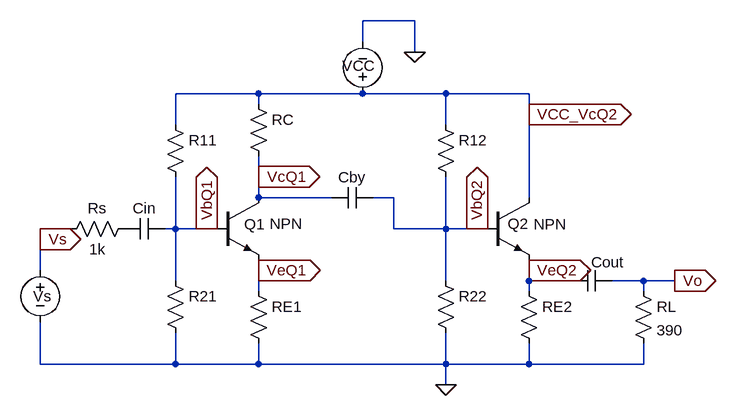
[diagram p0: schematic assigned_schematic_RsRL_only.asc]
assigned_schematic_RsRL_only.asc, the LTspice schematic file:
Version 4
SHEET 1 936 680
WIRE 416 -160 336 -160
WIRE 336 -128 336 -160
WIRE 416 -112 416 -160
WIRE 176 -48 48 -48
WIRE 336 -48 176 -48
WIRE 464 -48 336 -48
WIRE 592 -48 464 -48
WIRE 176 -32 176 -48
WIRE 592 -16 592 -48
WIRE 48 0 48 -48
WIRE 464 0 464 -48
WIRE 176 80 176 48
WIRE 176 112 176 80
WIRE 288 112 176 112
WIRE 384 112 352 112
WIRE 592 112 592 -16
WIRE -112 160 -160 160
WIRE 48 160 48 80
WIRE 48 160 32 160
WIRE 96 160 48 160
WIRE 112 160 96 160
WIRE 384 160 384 112
WIRE 464 160 464 80
WIRE 464 160 384 160
WIRE 512 160 464 160
WIRE 528 160 512 160
WIRE -160 176 -160 160
WIRE -160 224 -160 176
WIRE 176 224 176 208
WIRE 592 224 592 208
WIRE 48 240 48 160
WIRE 464 240 464 160
WIRE 592 240 592 224
WIRE 656 240 592 240
WIRE 768 240 720 240
WIRE 816 240 768 240
WIRE 176 256 176 224
WIRE 592 256 592 240
WIRE 768 256 768 240
WIRE -160 368 -160 304
WIRE 48 368 48 320
WIRE 48 368 -160 368
WIRE 176 368 176 336
WIRE 176 368 48 368
WIRE 464 368 464 320
WIRE 464 368 176 368
WIRE 592 368 592 336
WIRE 592 368 464 368
WIRE 768 368 768 336
WIRE 768 368 592 368
WIRE 464 400 464 368
FLAG 416 -112 0
FLAG 464 400 0
FLAG 816 240 Vo
IOPIN 816 240 Out
FLAG 592 -16 VCC_VcQ2
IOPIN 592 -16 Out
FLAG 512 160 VbQ2
IOPIN 512 160 Out
FLAG 96 160 VbQ1
IOPIN 96 160 Out
FLAG 176 224 VeQ1
IOPIN 176 224 Out
FLAG 176 80 VcQ1
IOPIN 176 80 Out
FLAG 592 224 VeQ2
IOPIN 592 224 Out
FLAG -160 176 Vs
IOPIN -160 176 Out
SYMBOL cap 352 96 R90
WINDOW 0 0 32 VBottom 2
WINDOW 3 32 32 VTop 2
SYMATTR InstName Cby
SYMATTR Value ""
SYMBOL res 32 -16 R0
SYMATTR InstName R11
SYMATTR Value ""
SYMBOL res 32 224 R0
SYMATTR InstName R21
SYMATTR Value ""
SYMBOL res 448 -16 R0
WINDOW 3 -33 28 Left 2
SYMATTR Value ""
SYMATTR InstName R12
SYMBOL res 448 224 R0
SYMATTR InstName R22
SYMATTR Value ""
SYMBOL res 160 -48 R0
SYMATTR InstName RC
SYMATTR Value ""
SYMBOL res 160 240 R0
SYMATTR InstName RE1
SYMATTR Value ""
SYMBOL res 576 240 R0
SYMATTR InstName RE2
SYMATTR Value ""
SYMBOL res 752 240 R0
SYMATTR InstName RL
SYMATTR Value 390
SYMBOL voltage 336 -32 R180
WINDOW 0 -19 59 Left 2
WINDOW 3 -37 99 Left 2
WINDOW 123 0 0 Left 0
WINDOW 39 0 0 Left 0
SYMATTR InstName VCC
SYMATTR Value ""
SYMBOL voltage -160 208 R0
WINDOW 0 -11 56 Left 2
WINDOW 3 39 70 Left 1
WINDOW 123 43 89 Left 1
WINDOW 39 0 0 Left 0
SYMATTR InstName Vs
SYMATTR Value ""
SYMBOL cap 720 224 R90
WINDOW 0 3 7 VBottom 2
WINDOW 3 23 5 VTop 2
SYMATTR InstName Cout
SYMATTR Value ""
SYMBOL cap 32 144 R90
WINDOW 0 0 32 VBottom 2
WINDOW 3 32 32 VTop 2
SYMATTR InstName Cin
SYMATTR Value ""
SYMBOL res -16 144 R90
WINDOW 0 0 56 VBottom 2
WINDOW 3 32 56 VTop 2
SYMATTR InstName Rs
SYMATTR Value 1k
SYMBOL npn 112 112 R0
WINDOW 0 42 41 Left 2
WINDOW 3 81 40 Left 2
SYMATTR InstName Q1
SYMBOL npn 528 112 R0
WINDOW 0 31 40 Left 2
WINDOW 3 71 41 Left 2
SYMATTR InstName Q2

The netlist it stands for:
* assigned_schematic_RsRL_only.asc
Cby VbQ2 VcQ1
R11 VCC_VcQ2 VbQ1
R21 VbQ1 0
R12 VCC_VcQ2 VbQ2
R22 VbQ2 0
RC VCC_VcQ2 VcQ1
RE1 VeQ1 0
RE2 VeQ2 0
RL Vo 0 390
VCC VCC_VcQ2 0
Vs Vs 0
Cout Vo VeQ2
Cin VbQ1 P001
Rs P001 Vs 1k
Q1 VcQ1 VbQ1 VeQ1 0 NPN
Q2 VCC_VcQ2 VbQ2 VeQ2 0 NPN
.model NPN NPN
.model PNP PNP
.lib standard.bjt
.backanno
.end